# Altium schematic sheet POWER.SchDoc
size 558 x 431 mm
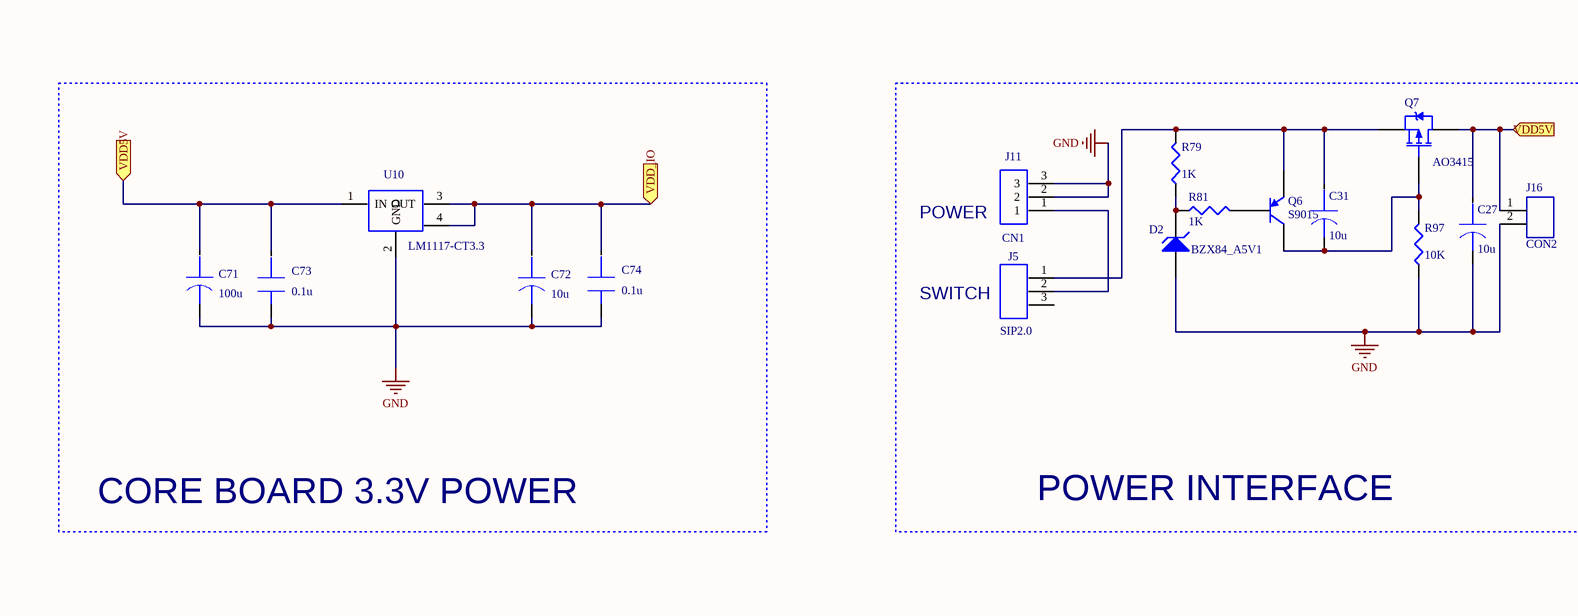
[diagram p0: POWER.SchDoc, top left]
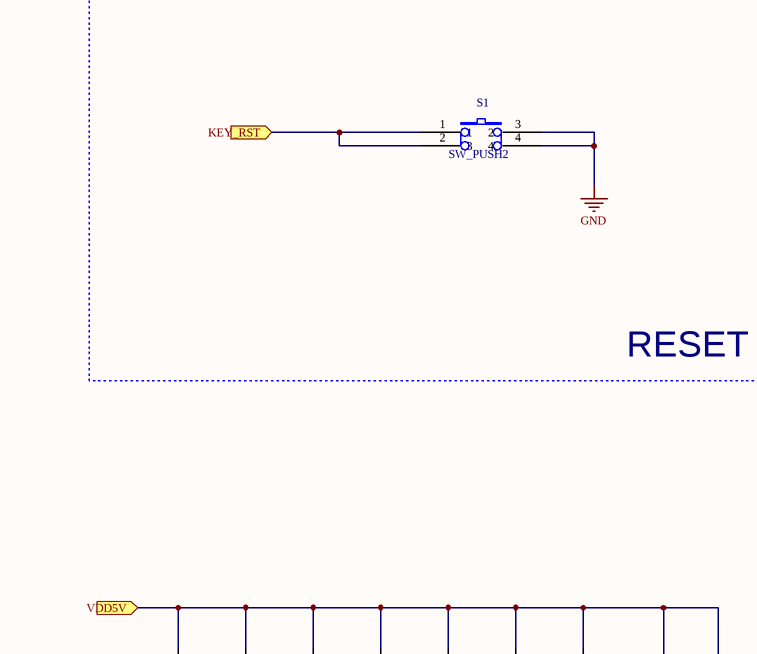
[diagram p1: POWER.SchDoc, top right]
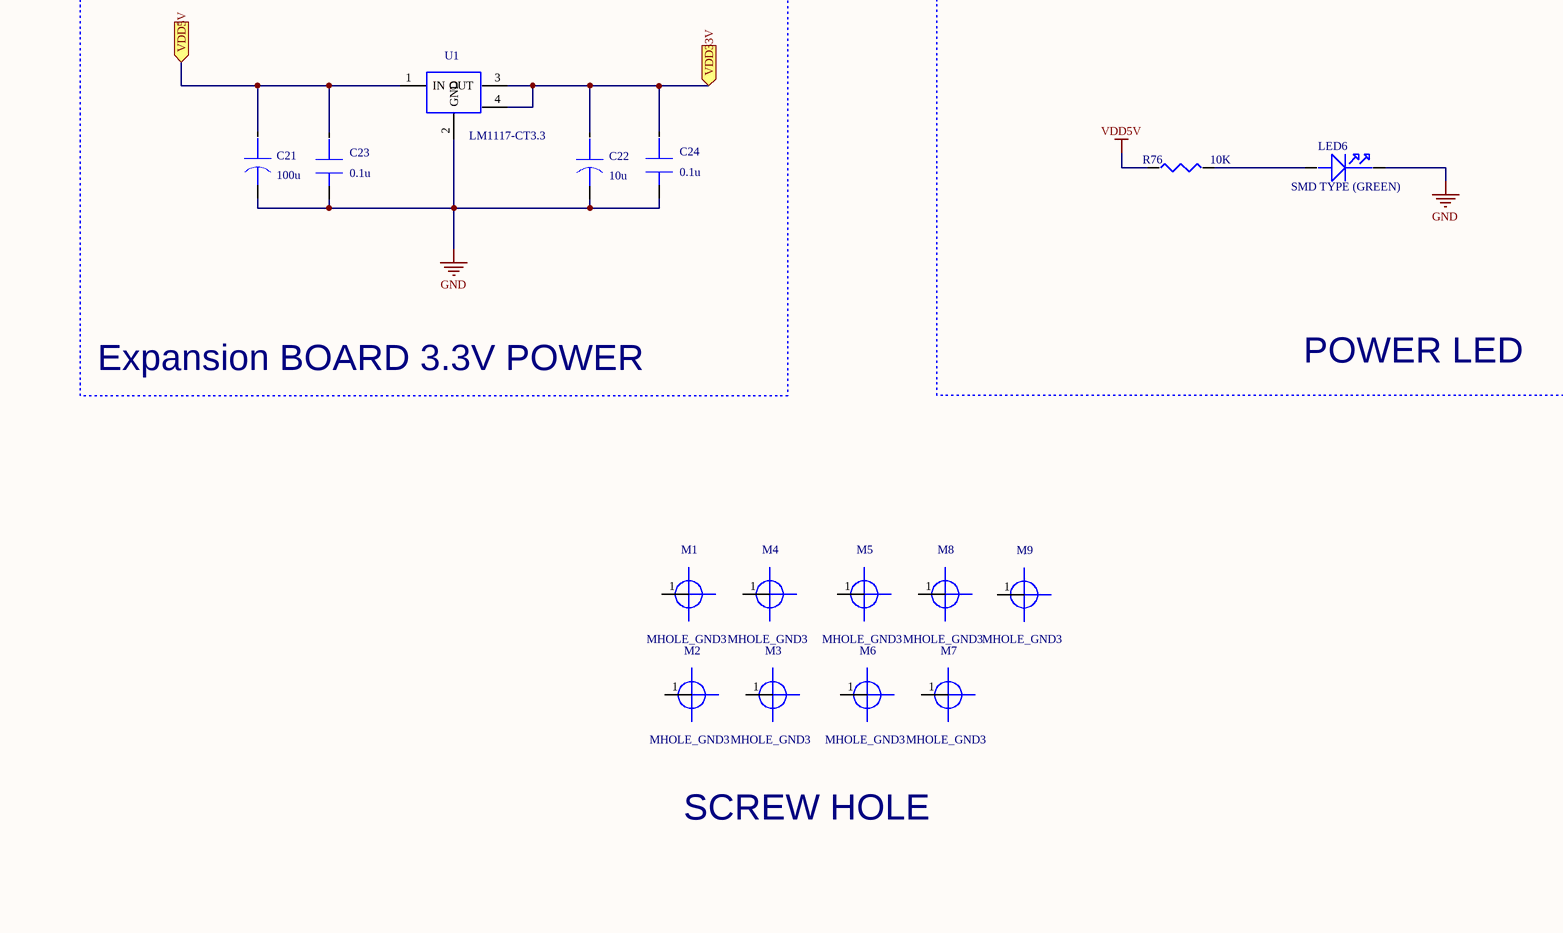
[diagram p2: POWER.SchDoc, bottom left]
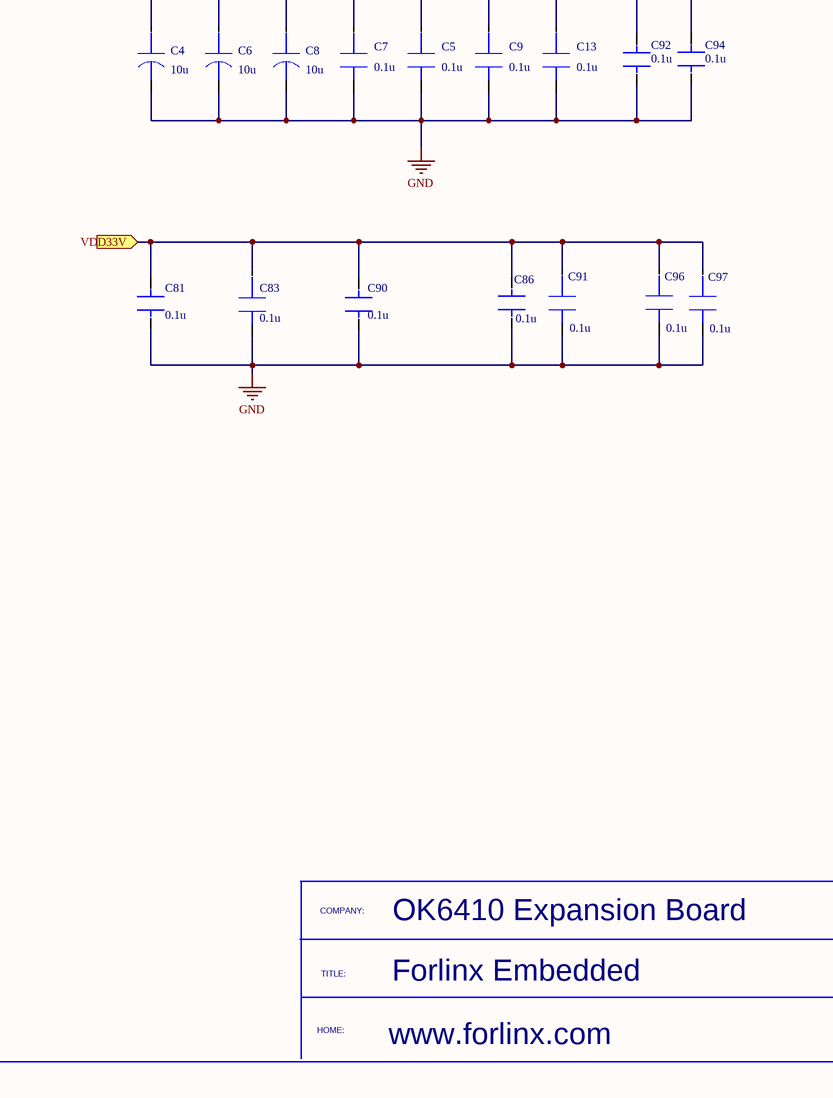
[diagram p3: POWER.SchDoc, bottom right]

## Parts
C4  value 10u  (hidden comment: CAP-AE4)
C5  value 0.1u  (hidden comment: CAP1206)
C6  value 10u  (hidden comment: CAP-AE4)
C7  value 0.1u  (hidden comment: CAP1206)
C8  value 10u  (hidden comment: CAP-AE4)
C9  value 0.1u  (hidden comment: CAP1206)
C13  value 0.1u  (hidden comment: CAP1206)
C21  value 100u  (hidden comment: CAP-AE4)
C22  value 10u  (hidden comment: CAP-AE4)
C23  value 0.1u  (hidden comment: CAP1206)
C24  value 0.1u  (hidden comment: CAP1206)
C27  value 10u  (hidden comment: CAP-AE4)
C31  value 10u  (hidden comment: CAP-AE4)
C71  value 100u  (hidden comment: CAP-AE4)
C72  value 10u  (hidden comment: CAP-AE4)
C73  value 0.1u  (hidden comment: CAP1206)
C74  value 0.1u  (hidden comment: CAP1206)
C81  value 0.1u  (hidden comment: CAP_0)
C83  value 0.1u  (hidden comment: CAP1206)
C86  value 0.1u  (hidden comment: CAP_0)
C90  value 0.1u  (hidden comment: CAP_0)
C91  value 0.1u  (hidden comment: CAP1206)
C92  value 0.1u  (hidden comment: CAP_0)
C94  value 0.1u  (hidden comment: CAP_0)
C96  value 0.1u  (hidden comment: CAP1206)
C97  value 0.1u  (hidden comment: CAP1206)
D2  BZX84_A5V1  [DIODE-0.7]
J5  SIP2.0
J11  CN1
J16  CON2  [SIP2S_2mm]
LED6  value SMD TYPE (GREEN)  (hidden comment: LED_0)
M1  MHOLE_GND3
M2  MHOLE_GND3
M3  MHOLE_GND3
M4  MHOLE_GND3
M5  MHOLE_GND3
M6  MHOLE_GND3
M7  MHOLE_GND3
M8  MHOLE_GND3
M9  MHOLE_GND3
Q6  S9015  [TO-92A]
Q7  AO3415  [TO-220AB]
R76  value 10K  (hidden comment: RESISTOR_2)
R79  value 1K  [J1-0603]  (hidden comment: Res3)
R81  value 1K  [J1-0603]  (hidden comment: Res3)
R97  value 10K  [J1-0603]  (hidden comment: Res3)
S1  SW_PUSH2
U1  LM1117-CT3.3
U10  LM1117-CT3.3

## Blocks framed on the sheet
CORE BOARD 3.3V POWER: C71-C74 U10
POWER INTERFACE: C27 C31 D2 J5 J11 J16 Q6 Q7 R79 R81 R97
RESET: S1
Expansion BOARD 3.3V POWER: C21-C24 U1
POWER LED: LED6 R76

## Ports
KEY_RST, VDD5V, VDD33V, VDD_IO

## Nets
GND: C4.2 C5.2 C6.2 C7.2 C8.2 C9.2 C13.2 C21.2 C22.2 C23.2 C24.2 C27.2 C71.2 C72.2 C73.2 C74.2 C81.2 C83.2 C86.2 C90.2 C91.2 C92.2 C94.2 C96.2 C97.2 D2.1(A) J11.2 J11.3 J16.2(DQ20) LED6.2 R97.1 S1.3(2) S1.4 U1.2(GND) U10.2(GND)
VDD5V: R76.1
KEY_RST: S1.1 S1.2(3) ; port KEY_RST
VDD5V: C4.1 C5.1 C6.1 C7.1 C8.1 C9.1 C13.1 C21.1 C23.1 C27.1 C71.1 C73.1 C92.1 C94.1 J16.1(DQ19) Q7.2(D) U1.1(IN) U10.1(IN) ; port VDD5V  [a separate net that carries the same name]
VDD33V: C22.1 C24.1 C81.1 C83.1 C86.1 C90.1 C91.1 C96.1 C97.1 U1.3(OUT) U1.4 ; port VDD33V
VDD_IO: C72.1 C74.1 U10.3(OUT) U10.4 ; port VDD_IO
NetC31_1: C31.1 J5.1 Q6.1(E) Q7.3(S) R79.2
NetC31_2: C31.2 Q6.3(C) Q7.1(G) R97.2
NetD2_2: D2.2(K) R79.1 R81.1
NetJ5_2: J5.2 J11.1
NetLED6_1: LED6.1 R76.2
NetQ6_2: Q6.2(B) R81.2

Not connected (* = marked no-connect by the designer): J5 3; M1 1; M2 1; M3 1; M4 1; M5 1; M6 1; M7 1; M8 1; M9 1

## Notes on the sheet
- POWER
- SWITCH
- SCREW HOLE
- COMPANY:
- OK6410 Expansion Board
- TITLE:
- Forlinx Embedded
- HOME:
- www.forlinx.com

## Library data of the parts
C4 C6 C8 C21 C22 C27 C31 C71 C72 = CAP-AE4: ALUMINUM ELECTROLYTIC CAP.; Manufacturer #1: IPC SM-782 STD.; PCB DECAL: 3216A
C5 C7 C9 C13 C23 C24 C73 C74 C83 C91 C96 C97 = CAP1206: SURFACE MOUNT CAPACITOR 0.062 X 0.126 INCHES; Manufacturer #1: IPC SM-782 STD.; PCB DECAL: 0603A
C81 C86 C90 C92 C94 = CAP_0: PCB Footprint: C0805; Source Path: C:\ORCADWIN\CAPTURE\DESIGN\MCU\S3C2400X\EV-BOARD\SMDK2400-72F.DSN; PCB DECAL: 0603A
D2 = D Zener: Zener Diode; Published: 8-Jun-2000; LatestRevisionDate: 17-Jul-2002; LatestRevisionNote: Re-released for DXP Platform.; PackageReference: DIODE-0.7; Publisher: Altium Limited; PackageDescription: Diode, Thru-Hole; 2 Leads; 0.7 in Pin Spacing
J5 = SIP2.0: PCB DECAL: SWITCH_A
J11 = CN1: PCB DECAL: JACK-2.5MM_B
LED6 = LED_0: PCB Footprint: CAP3528; PCB DECAL: LED1206N
M1-M9 = MHOLE_GND3: PCB DECAL: HOLE157-8STAR
Q6 = 2N3906: PNP General Purpose Amplifier; Published: 8-Jun-2000; LatestRevisionDate: 15-Jan-2003; LatestRevisionNote: PCB Footprint 'BCY-W3/D4.7' replaced; DatasheetVersion: 1997; PackageVersion: Sep-1998; PackageReference: TO-92A; Publisher: Altium Limited; PackageDescription: TO, Flat Index; 3 In-Line, Axial Leads; Body Dia. 4.5mm; Leads 0.51 x 0.48 mm (max); ComponentLink1Description: Manufacturer Link; ComponentLink1URL: http://www.fairchildsemi.com/; ComponentLink2Description: Datasheet; ComponentLink2URL: http://www.fairchildsemi.com/ds/2N%2F2N3906.pdf
Q7 = PMOS-2: P-Channel Power MOSFET; Note: Pin 4 not drawn and electrically connected to Pin 2.; Published: 8-Jun-2000; LatestRevisionDate: 17-Jul-2002; LatestRevisionNote: Re-released for DXP Platform.; DatasheetVersion: PD-9.390D; PackageVersion: Feb-1997; PackageReference: TO-220AB; Publisher: Altium Limited; PackageDescription: TO, Thru-Hole, Vertical, Heatsink Mounted; 3 In-Line Leads; Pitch 2.54 mm; ComponentLink1Description: Manufacturer Link; ComponentLink1URL: http://www.irf.com/
R76 = RESISTOR_2: PCB Footprint: C2012; PCB DECAL: 0603A
R79 R81 R97 = Res3: Resistor; Published: 8-Jun-2000; LatestRevisionDate: 29-May-2009; LatestRevisionNote: IPC-7351 Footprint Added.; PackageReference: J1-0603; Publisher: Altium Limited; PackageDescription: Chip Resistor
S1 = SW_PUSH2: PCB Footprint: TM118D-A; PCB DECAL: PUSHSW1
U1 U10 = LM1117-CT3.3: PCB DECAL: TO-252L